# EAGLE design Pixel-X_Main_Control_v11 (EAGLE 7.7.0)
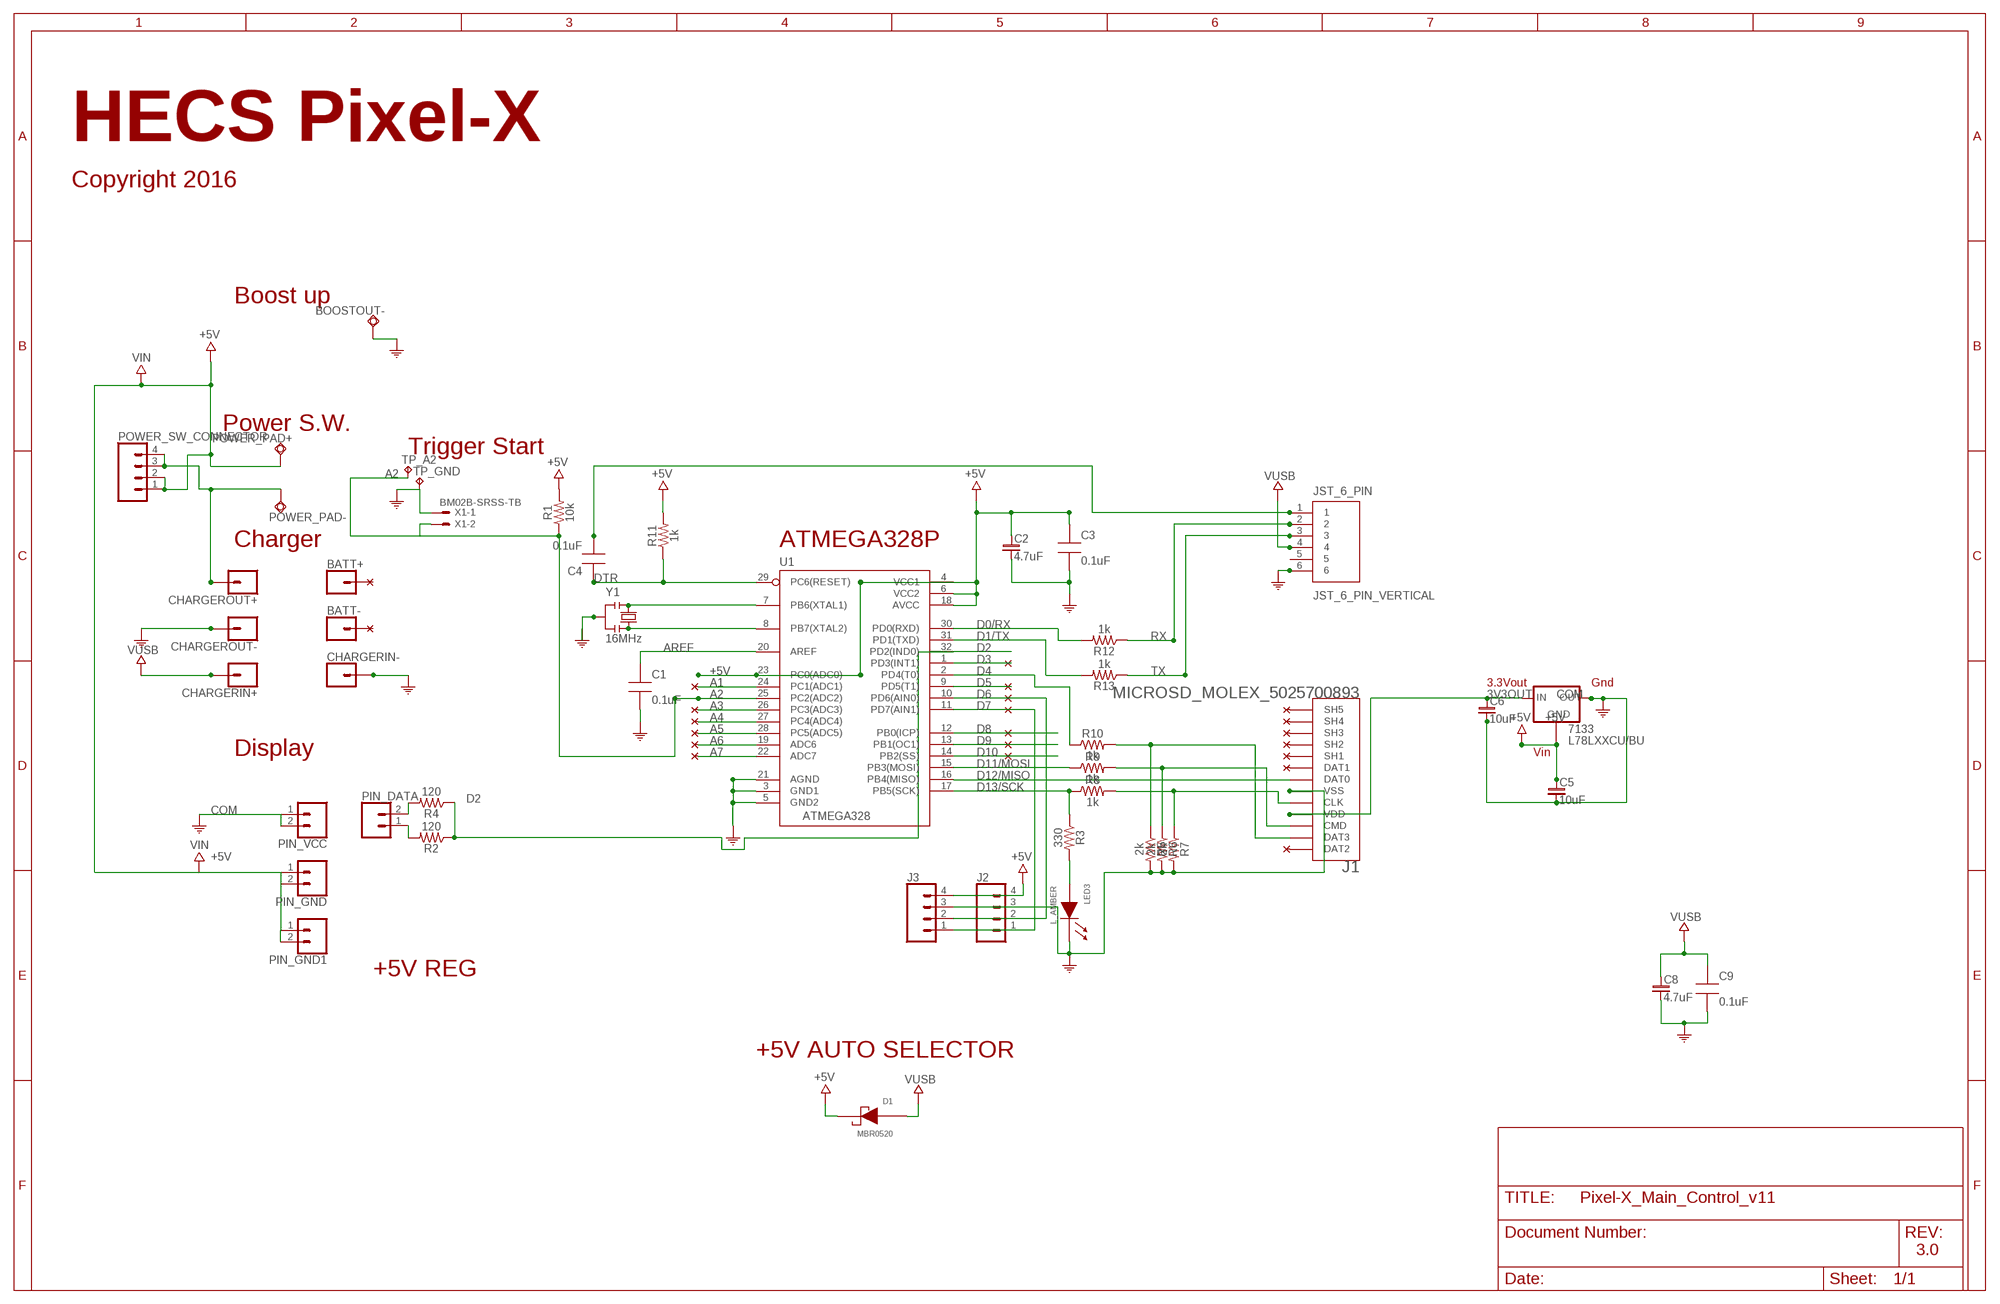
[diagram p0: schematic, sheet 1]

## Parts
7133  L78LXXCU/BU  [SOT89]
BATT+  CONN_01OFFSET  [1X01_OFFSET]
BATT-  CONN_01OFFSET  [1X01_OFFSET]
BOOSTOUT-  TPSQTP20R  [TP20R]
C1  0.1uF  CAP0805-NP  [CAP0805-NP]
C2  4.7uF  C_0805  [C0805]
C3  0.1uF  CAP0805-NP  [CAP0805-NP]
C4  0.1uF  CAP0805-NP  [CAP0805-NP]
C5  10uF  C_0805  [C0805]
C6  10uF  C_0805  [C0805]
C8  4.7uF  C_0805  [C0805]
C9  0.1uF  CAP0805-NP  [CAP0805-NP]
CHARGERIN+  CONN_01OFFSET  [1X01_OFFSET]
CHARGERIN-  CONN_01OFFSET  [1X01_OFFSET]
CHARGEROUT+  CONN_01OFFSET  [1X01_OFFSET]
CHARGEROUT-  CONN_01OFFSET  [1X01_OFFSET]
D1  MBR0520  [SOD-123]
J1  MICROSD_MOLEX_5025700893  [5025700893]
J2  CONN_04SMD2  [1X04_1MM_RA]
J3  CONN_04  [1X04]
JST_6_PIN  JST_6_PIN_VERTICAL  [JST-6-SMD-VERT-1.0MM]
LED3  L_AMBER  LED0805  [LED0805]
PIN_DATA  CONN_02  [1X02]
PIN_GND  CONN_02  [1X02]
PIN_GND1  CONN_02  [1X02]
PIN_VCC  CONN_02  [1X02]
POWER_PAD+  TPSQTP20R  [TP20R]
POWER_PAD-  TPSQTP20R  [TP20R]
POWER_SW_CONNECTOR  CONN_04SMD2  [1X04_1MM_RA]
R1  10k  0.05OHM-0603-1/5W-1%  [0603]
R2  120  0.05OHM-0603-1/5W-1%  [0603]
R3  330  0.05OHM-0603-1/5W-1%  [0603]
R4  120  0.05OHM-0603-1/5W-1%  [0603]
R5  2k  0.05OHM-0603-1/5W-1%  [0603]
R6  2k  0.05OHM-0603-1/5W-1%  [0603]
R7  2k  0.05OHM-0603-1/5W-1%  [0603]
R8  1k  0.05OHM-0603-1/5W-1%  [0603]
R9  1k  0.05OHM-0603-1/5W-1%  [0603]
R10  1k  0.05OHM-0603-1/5W-1%  [0603]
R11  1k  0.05OHM-0603-1/5W-1%  [0603]
R12  1k  0.05OHM-0603-1/5W-1%  [0603]
R13  1k  0.05OHM-0603-1/5W-1%  [0603]
TP_A2  TPTP12R  [TP12R]
TP_GND  TPTP12R  [TP12R]
U1  ATMEGA328  ATMEGA168-20AU  [QFP032]
X1  BM02B-SRSS-TB  [BM02B-SRSS-TB]
Y1  16MHz  RESONATORMU  [RESONATOR]

## Nets
3V3OUT: 7133.3(IN) C6.1 J1.P$4(VDD)
+5V: 7133.4(GND1) C2.1 C3.1 C5.1 D1.1(CA) J2.4 J3.4 PIN_GND1.1 PIN_GND1.2 PIN_GND.1 PIN_GND.2 POWER_PAD+.TP POWER_SW_CONNECTOR.1 POWER_SW_CONNECTOR.2 R1.2 R11.2 U1.4(VCC1) U1.6(VCC2) U1.18(AVCC) U1.23(PC0(ADC0)) ; supply symbol labelled VIN
A1: U1.24(PC1(ADC1))
A2: R1.1 TP_A2.TP U1.25(PC2(ADC2)) X1.2
A3: U1.26(PC3(ADC3))
A4: U1.27(PC4(ADC4))
A5: U1.28(PC5(ADC5))
A6: U1.19(ADC6)
A7: U1.22(ADC7)
AREF: C1.1 U1.20(AREF)
COM: 7133.1(OUT) BOOSTOUT-.TP C1.2 C2.2 C3.2 C5.2 C6.2 C8.2 C9.2 CHARGERIN-.1 CHARGEROUT-.1 J1.P$6(VSS) J2.3 J3.3 JST_6_PIN.6 LED3.1(CA) PIN_VCC.1 PIN_VCC.2 R5.2 R6.2 R7.2 TP_GND.TP U1.3(GND1) U1.5(GND2) U1.21(AGND) X1.1 Y1.2
D0/RX: R12.2 U1.30(PD0(RXD))
D1/TX: R13.2 U1.31(PD1(TXD))
D2: R2.1 R4.1 U1.32(PD2(IND0))
D3: U1.1(PD3(INT1))
D4: R10.1 U1.2(PD4(T0))
D5: U1.9(PD5(T1))
D6: J2.2 J3.2 U1.10(PD6(AIN0))
D7: J2.1 J3.1 U1.11(PD7(AIN1))
D8: U1.12(PB0(ICP))
D9: U1.13(PB1(OC1))
D10: U1.14(PB2(SS))
D11/MOSI: R9.1 U1.15(PB3(MOSI))
D12/MISO: J1.P$7(DAT0) U1.16(PB4(MISO))
D13/SCK: R3.1 R8.1 U1.17(PB5(SCK))
DTR: C4.1 R11.1 U1.29(PC6(RESET))
N$1: U1.8(PB7(XTAL2)) Y1.3
N$2: U1.7(PB6(XTAL1)) Y1.1
N$4: PIN_DATA.2 R4.2
N$5: PIN_DATA.1 R2.2
N$6: C4.2 JST_6_PIN.1
N$7: LED3.2(AN) R3.2
N$28: J1.P$2(DAT3) R5.1 R10.2
N$29: J1.P$3(CMD) R6.1 R9.2
N$30: J1.P$5(CLK) R7.1 R8.2
N$31: CHARGEROUT+.1 POWER_PAD-.TP POWER_SW_CONNECTOR.3 POWER_SW_CONNECTOR.4
RX: JST_6_PIN.2 R12.1
TX: JST_6_PIN.3 R13.1
VUSB: C8.1 C9.1 CHARGERIN+.1 D1.2(AN) JST_6_PIN.4
Unconnected: 7133.2(GND) BATT+.1 BATT-.1 J1.P$1(DAT2) J1.P$8(DAT1) JST_6_PIN.5

## Notes on the sheet
- HECS Pixel-X
- Copyright 2016
- Boost up
- Power S.W.
- Trigger Start
- Charger | ATMEGA328P
- 3.3Vout | Gnd
- Display | Vin
- +5V REG
- +5V AUTO SELECTOR
- 3.0

## Power pins joined to a net without a drawn wire
SH1: J1.GND0(SH1)
SH2: J1.GND1(SH2)
SH3: J1.GND2(SH3)
SH4: J1.GND3(SH4)
SH5: J1.GND4(SH5)

## Library data of the parts
7133 = v-reg-2:L78LXXCU/BU: VOLTAGE REGULATOR
BATT+ BATT- CHARGERIN+ CHARGERIN- CHARGEROUT+ CHARGEROUT- = SparkFun-Connectors:CONN_01: Single connection point. Often used as Generic Header-pin footprint for 0.1 inch spaced/style header connections On any of the 0.1 inch spaced packages, you can populate with these: Break Away Headers - Straight <https://www.sparkfun.com/products/116> (PRT-00116) Break Away Male Headers - Right Angle <https://www.sparkfun.com/products/553> (PRT-00553) Female Headers <https://www.sparkfun.com/products/115> (PRT-00115) Break Away Headers - Machine Pin <https://www.sparkfun.com/products/117> (PRT-00117) Break Away Female Headers - Swiss Machine Pin <https://www.sparkfun.com/products/743> (PRT-00743) This device is also useful as a general connection point to wire up your design to another part of your project. Our various solder wires solder well into these plated through hole pads. Hook-Up Wire - Assortment (Stranded, 22 AWG) <https://www.sparkfun.com/products/11375> (PRT-11375) Hook-Up Wire - Assortment (Solid Core, 22 AWG) <https://www.sparkfun.com/products/11367> (PRT-11367) View the entire wire category on our website here <https://www.sparkfun.com/categories/141> Special notes: SMTSO-256-ET is a "flush mount" nut for a 4-40 screw. We mostly use this on specialty testbeds; it is a nice way to connect hardware to your PCB at an adjustable hieght. Also note, the SNAP packages are for using a snappable style connector. We sell a baggie of snaps and they are also used on two LilyPad designs: Snap Assortment - 30 pack (male and female) <https://www.sparkfun.com/products/11347> (DEV-11347) LilyPad Arduino SimpleSnap <https://www.sparkfun.com/products/10941> (DEV-10941) LilyPad SimpleSnap Protoboard <https://www.sparkfun.com/products/10940> (DEV-10940)
BOOSTOUT- POWER_PAD+ POWER_PAD- = testpad:TPSQ: Test pad
C1 C3 C4 C9 = MySMD:CAP0805-NP
C2 C5 C6 C8 = rc-master-smd:C_: NON-POLARIZED CAP
D1 = MySMD:MBR0520
J1 = j_microsd_molex_5025700893:MICROSD_MOLEX_5025700893: Molex 5025700893 MicroSD Normal Mount SMT Connector
J2 POWER_SW_CONNECTOR = SparkFun-Connectors:CONN_04: Multi connection point. Often used as Generic Header-pin footprint for 0.1 inch spaced/style header connections On any of the 0.1 inch spaced packages, you can populate with these: Break Away Headers - Straight <https://www.sparkfun.com/products/116> (PRT-00116) Break Away Male Headers - Right Angle <https://www.sparkfun.com/products/553> (PRT-00553) Female Headers <https://www.sparkfun.com/products/115> (PRT-00115) Break Away Headers - Machine Pin <https://www.sparkfun.com/products/117> (PRT-00117) Break Away Female Headers - Swiss Machine Pin <https://www.sparkfun.com/products/743> (PRT-00743) For SCREWTERMINALS and SPRING TERMINALS visit here: Screw Terimnals on SparkFun.com <https://www.sparkfun.com/search/results?term=Screw+Terminals> (5mm/3.5mm/2.54mm spacing) This device is also useful as a general connection point to wire up your design to another part of your project. Our various solder wires solder well into these plated through hole pads. Hook-Up Wire - Assortment (Stranded, 22 AWG) <https://www.sparkfun.com/products/11375> (PRT-11375) Hook-Up Wire - Assortment (Solid Core, 22 AWG) <https://www.sparkfun.com/products/11367> (PRT-11367) View the entire wire category on our website here <https://www.sparkfun.com/categories/141> Special notes: Molex polarized connector foot print use with SKU : PRT-08231 with associated crimp pins and housings. 1MM SMD Version SKU: PRT-10208; PROD_ID: CONN-10310; SF_ID: PRT-10208
J3 = SparkFun-Connectors:CONN_04: Multi connection point. Often used as Generic Header-pin footprint for 0.1 inch spaced/style header connections On any of the 0.1 inch spaced packages, you can populate with these: Break Away Headers - Straight <https://www.sparkfun.com/products/116> (PRT-00116) Break Away Male Headers - Right Angle <https://www.sparkfun.com/products/553> (PRT-00553) Female Headers <https://www.sparkfun.com/products/115> (PRT-00115) Break Away Headers - Machine Pin <https://www.sparkfun.com/products/117> (PRT-00117) Break Away Female Headers - Swiss Machine Pin <https://www.sparkfun.com/products/743> (PRT-00743) For SCREWTERMINALS and SPRING TERMINALS visit here: Screw Terimnals on SparkFun.com <https://www.sparkfun.com/search/results?term=Screw+Terminals> (5mm/3.5mm/2.54mm spacing) This device is also useful as a general connection point to wire up your design to another part of your project. Our various solder wires solder well into these plated through hole pads. Hook-Up Wire - Assortment (Stranded, 22 AWG) <https://www.sparkfun.com/products/11375> (PRT-11375) Hook-Up Wire - Assortment (Solid Core, 22 AWG) <https://www.sparkfun.com/products/11367> (PRT-11367) View the entire wire category on our website here <https://www.sparkfun.com/categories/141> Special notes: Molex polarized connector foot print use with SKU : PRT-08231 with associated crimp pins and housings. 1MM SMD Version SKU: PRT-10208; PROD_ID: CONN-09696
JST_6_PIN = SparkFun-Connectors:JST_6_PIN_VERTICAL: JST 6 pin vertical connector Here is a six pin vertical 1.0mm pitch connector. It is useful if you need something very tiny as a connection. These are not the standard JST type connectors we use on most of our boards, but are actually the much smaller JST-SH type. Here is the connector we sell at SparkFun: JST SH Vertical 6-Pin Connector - SMD <https://www.sparkfun.com/products/579> (GPS-00579) Datasheet <http://www.sparkfun.com/datasheets/GPS/EM406-SMDConnector-eSH.pdf> It was used on these SparkFun products: SparkFun GPS Breakout <https://www.sparkfun.com/products/11818> (BOB-11818) SparkFun Weather Shield <https://www.sparkfun.com/products/12081> (DEV-12081) And many, many other GPS related products.; PROD_ID: CONN-08249; SF_ID: GPS-00579
LED3 = MySMD:LED0805
PIN_DATA PIN_GND PIN_GND1 PIN_VCC = SparkFun-Connectors:CONN_02: Multi connection point. Often used as Generic Header-pin footprint for 0.1 inch spaced/style header connections On any of the 0.1 inch spaced packages, you can populate with these: Break Away Headers - Straight <https://www.sparkfun.com/products/116> (PRT-00116) Break Away Male Headers - Right Angle <https://www.sparkfun.com/products/553> (PRT-00553) Female Headers <https://www.sparkfun.com/products/115> (PRT-00115) Break Away Headers - Machine Pin <https://www.sparkfun.com/products/117> (PRT-00117) Break Away Female Headers - Swiss Machine Pin <https://www.sparkfun.com/products/743> (PRT-00743) For SCREWTERMINALS and SPRING TERMINALS visit here: Screw Terimnals on SparkFun.com <https://www.sparkfun.com/search/results?term=Screw+Terminals> (5mm/3.5mm/2.54mm spacing) This device is also useful as a general connection point to wire up your design to another part of your project. Our various solder wires solder well into these plated through hole pads. Hook-Up Wire - Assortment (Stranded, 22 AWG) <https://www.sparkfun.com/products/11375> (PRT-11375) Hook-Up Wire - Assortment (Solid Core, 22 AWG) <https://www.sparkfun.com/products/11367> (PRT-11367) View the entire wire category on our website here <https://www.sparkfun.com/categories/141> Special notes: Molex polarized connector foot print use with: PRT-08233 with associated crimp pins and housings. 2.54_SCREWTERM for use with PRT-10571. 3.5mm Screw Terminal footprints for PRT-08084 5mm Screw Terminal footprints for use with PRT-08432
R1-R13 = SparkFun-Resistors:0.05OHM: 0.05Ω resistor A resistor is a passive two-terminal electrical component that implements electrical resistance as a circuit element. Resistors act to reduce current flow, and, at the same time, act to lower voltage levels within circuits. - Wikipedia; PROD_ID: RES-12535; VALUE: 0.05
TP_A2 TP_GND = testpad:TP: Test pad
U1 = MySMD:ATMEGA168-20AU
X1 = con-jst2:?M02B-SRSS-TB: Disconnectable Crimp style connector, 1.0mm pitch 2 contacts
Y1 = MySMD2:RESONATOR

## Board
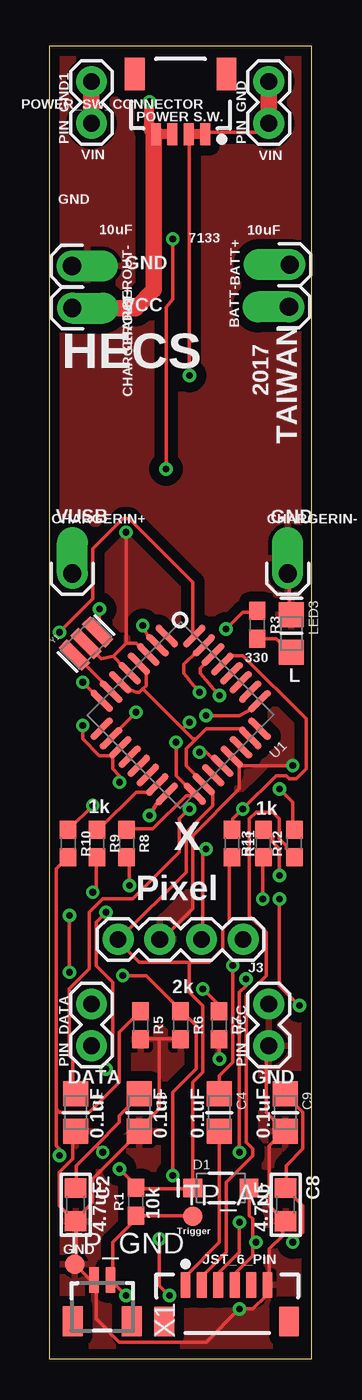
[diagram p1: board, top side]
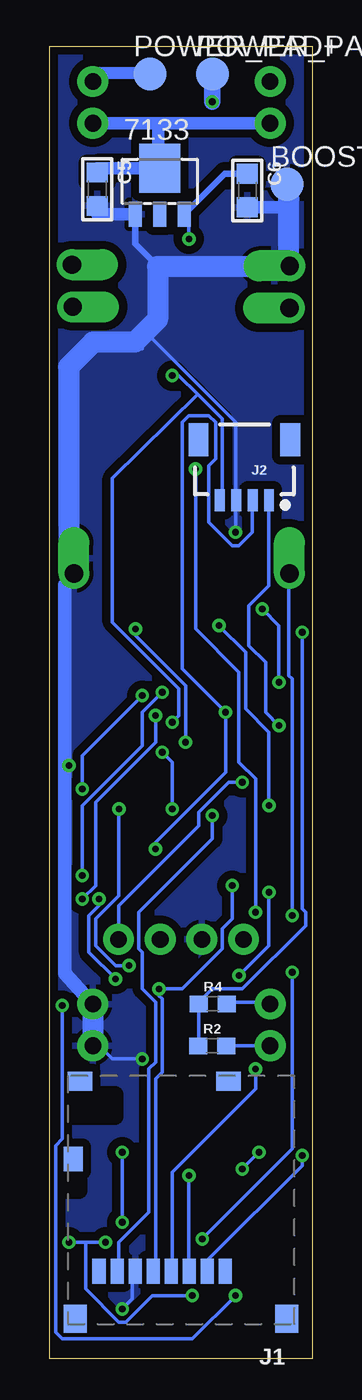
[diagram p2: board, bottom side, seen from below]

Size 16 x 80 mm. Coordinates in mm from the lower left corner, seen from the top.
Outline: 0,0 16,0 16,80 0,80 0,0
Copper layers (1*16): Top 0.035mm / dielectric 1.5mm / Bottom 0.035mm
Design rules "default *": minimum track width 8mil, minimum drill 16mil, track to track 8mil, track to pad 8mil, pad to pad 8mil, via to via 8mil, smd to smd 8mil, copper to edge 8mil, drill to drill 8mil, minimum pad ring 12mil, minimum via ring 8mil, stop-mask expansion 4mil, vias tented up to drill 18mil, thermal gap 10mil

### Footprints (pad centres in the part's own frame; a part is rotated, then mirrored left to right if it is on the bottom)
SOT89 = smd 0.8 x 1.5: 1 -1.5,-1.75; 2 0,-1.75; 3 1.5,-1.75 | smd 2.5 x 3: 4 0,1.05
1X01_OFFSET = drill 1.118 pad 1.88 offset: 1 0,0
TP20R = smd 2 x 2: TP 0,0
CAP0805-NP = smd 1.524 x 1.524: 1 0,0; 2 2.286,0
C0805 = smd 1.2 x 1.3: 1 -1.016,0; 2 1.016,0
SOD-123 = smd 1.143 x 1.143: 1 0,0; 2 3.429,0
5025700893 = smd 1.4 x 1.7: GND0 6.45,7.1; GND2 -6.45,7.1 | smd 1.5 x 1.15: GND1 6.15,-7.375; GND3 -2.9,-7.375 | smd 1.15 x 1.5: GND4 6.575,-2.65 | smd 0.8 x 1.5: P$1 -2.7,4.2; P$2 -1.6,4.2; P$3 -0.5,4.2; P$4 0.6,4.2; P$5 1.7,4.2; P$6 2.8,4.2; P$7 3.9,4.2; P$8 5,4.2
1X04_1MM_RA = smd 0.6 x 1.35: 1 -1.5,0; 2 -0.5,0; 3 0.5,0; 4 1.5,0 | smd 1.2 x 2: NC1 2.8,-3.675; NC2 -2.8,-3.675
1X04 = drill 1.016 pad 1.88: 1 0,0; 2 2.54,0; 3 5.08,0; 4 7.62,0
JST-6-SMD-VERT-1.0MM = smd 0.6 x 1.55: 1 -2.54,1.27; 2 -1.54,1.27; 3 -0.54,1.27; 4 0.46,1.27; 5 1.46,1.27; 6 2.46,1.27 | smd 1.2 x 1.8: P$1 -3.84,-0.955; P$2 3.76,-0.955
LED0805 = smd 1.524 x 1.524: 1 0,0; 2 2.286,0
1X02 = drill 1.016 pad 1.88: 1 0,0; 2 2.54,0
0603 = smd 1.1 x 1: 1 -0.85,0; 2 0.85,0
TP12R = smd 1.2 x 1.2: TP 0,0
QFP032 = smd 0.432 x 1.778: 1 0,0; 2 0.8,0; 3 1.599,0; 4 2.399,0; 5 3.199,0; 6 3.998,0; 7 4.798,0; 8 5.598,0; 17 5.588,8.001; 18 4.798,7.997; 19 3.998,7.997; 20 3.199,7.997; 21 2.399,7.997; 22 1.599,7.997; 23 0.799,7.997; 24 0,7.997 | smd 1.778 x 0.432: 9 6.807,1.194; 10 6.807,2.007; 11 6.807,2.794; 12 6.807,3.607; 13 6.807,4.394; 14 6.807,5.182; 15 6.807,5.994; 16 6.816,6.803; 25 -1.194,6.807; 26 -1.194,5.994; 27 -1.194,5.182; 28 -1.194,4.394; 29 -1.194,3.607; 30 -1.194,2.794; 31 -1.194,2.007; 32 -1.194,1.194
BM02B-SRSS-TB = smd 0.6 x 1.55: 1 0.5,-1.625; 2 -0.5,-1.625 | smd 1.2 x 1.8: FIT@1 1.8,0.9; FIT@2 -1.8,0.9
RESONATOR = smd 0.7 x 2: 1 -1,0; 2 0,0; 3 1,0

### Placement (x,y rotation side)
7133  9.3,71.53 0 bottom
BATT+  14.66,66.7 90 top
BATT-  14.61,64.14 90 top
BOOSTOUT-  1.55,71.6 0 bottom
C1  1.6,16.16 270 top
C2  1.6,9.41 270 top
C3  5.49,16.16 270 top
C4  10.36,16.16 270 top
C5  13.11,71.3 270 bottom
C6  3.96,71.22 270 bottom
C8  14.4,9.41 270 top
C9  14.38,16.16 270 top
CHARGERIN+  1.4,47.88 0 top
CHARGERIN-  14.53,47.88 0 top
CHARGEROUT+  1.4,64.06 270 top
CHARGEROUT-  1.37,66.62 270 top
D1  8.74,10.42 0 top
J1  8,9.55 180 bottom
J2  4.14,52.35 180 bottom
J3  11.81,25.58 180 top
JST_6_PIN  10.84,3.25 0 top
LED3  14.76,45.36 270 top
PIN_DATA  2.57,19.09 90 top
PIN_GND  13.38,75.32 90 top
PIN_GND1  2.57,75.32 90 top
PIN_VCC  13.38,19.09 90 top
POWER_PAD+  9.91,78.33 0 bottom
POWER_PAD-  6.1,78.33 0 bottom
POWER_SW_CONNECTOR  8,74.65 180 top
R1  5.28,9.59 90 top
R2  6.1,19.08 0 bottom
R3  12.67,44.75 270 top
R4  6.07,21.64 0 bottom
R5  5.56,20.35 270 top
R6  8,20.35 270 top
R7  10.34,20.35 270 top
R8  4.7,31.42 270 top
R9  2.9,31.42 270 top
R10  1.14,31.42 270 top
R11  11.13,31.42 270 top
R12  14.94,31.42 90 top
R13  13.06,31.42 90 top
TP_A2  8.74,8.7 0 top
TP_GND  1.55,5.77 0 top
U1  7.15,44.07 225 top
X1  3.23,3.2 180 top
Y1  2.24,43.61 45 top

### Tracks (layer width: path | path; a pad name or v marks a point on that pad's centre or on a via)
3V3OUT  (via drill 0.41)
  Top 0.203: v3.45,17.68 3.45,18.09 3.86,18.49 3.86,22.96 2.85,23.98 2.85,26.62 v3.45,27.23 | v7.11,54.25 7.11,64.11 7.52,64.59 v7.52,68.28
  Bottom 0.203: v3.45,17.68 3.45,16.46 8.53,11.38 8.53,5.49 J1.P$4 | v3.45,27.23 3.45,35.36 4.47,36.37 4.47,41.86 7.11,44.5 v7.11,54.25 | v7.52,68.28 7.52,69.9 7133.3
  Bottom 0.406: C6.1 5.33,72.24 7133.3
+5V  (via drill 0.41)
  Top 0.203: 2.55,75.59 PIN_GND1.1 | 13.37,74.95 PIN_GND.1 13.01,74.78 9.75,74.78 POWER_SW_CONNECTOR.1 | v8.53,59.94 8.53,74.37 POWER_SW_CONNECTOR.2 | 5.69,40.84 5.89,41.05 5.89,41.86 5.49,42.27 U1.4 | 5.69,40.84 5.49,40.64 5.28,40.64 4.7,40.87 4.47,41.05 U1.6 | 8.94,37.8 9.55,38.41 11.79,38.41 12.19,38 U1.23 | 8.94,37.8 8.33,37.19 8.33,36.17 9.35,35.15 U1.18 9.55,34.95 9.55,34.8 9.96,34.39 9.96,33.73 8.33,32.11 8.33,29.67 4.27,25.6 J3.4 4.27,25.4 5.49,24.18 8.53,24.18 | 8.13,38.41 8.74,37.8 8.94,37.8 | 8.13,38.41 5.69,40.84 | 2.85,13.01 4.27,14.43 4.27,14.83 5.49,16.05 C3.1 | 2.85,13.01 1.63,11.79 1.63,10.57 C2.1 | 8.53,24.18 9.75,24.18 10.57,24.99 10.57,26.21 10.97,26.62 10.97,30.48 R11.2 | 8.53,24.18 8.53,22.35 9.35,21.54 9.35,17.48 8.74,16.87 D1.1 8.74,10.36 5.28,10.36 R1.2 5.28,10.57 v4.27,11.58 | v3.25,12.6 2.85,13.01 | 8.13,38.41 v8.53,38.81
  Top 0.61: POWER_SW_CONNECTOR.1 POWER_SW_CONNECTOR.2
  Top 0.762: 2.55,77.81 PIN_GND1.2 | 13.34,74.93 13.34,75.25 PIN_GND.1 | 13.37,78.12 PIN_GND.2
  Top 1: 2.55,77.81 2.55,75.59 | 13.37,74.95 13.37,78.12
  Bottom 0.203: 9.93,78.38 POWER_PAD+.TP | 6.99,58.8 8.13,59.94 v8.53,59.94 | 6.99,58.8 5.49,57.3 5.49,52.43 J2.4 | v4.27,11.58 v3.25,12.6 | 6.99,58.8 12.19,53.67 12.19,44.91 8.13,40.84 8.13,39.22 v8.53,38.81
  Bottom 0.762: 9.93,78.38 13.36,78.36 PIN_GND.2 | PIN_GND1.1 9.4,75.32 | 9.4,75.32 PIN_GND.1 | 9.4,75.32 9.4,72.58 7133.4 13.11,72.58 C5.1
A2  (via drill 0.41)
  Top 0.203: TP_A2.TP 8.74,8.74 R1.1 5.28,8.53 3.86,7.11 3.86,4.88 X1.2 3.86,4.67 v4.67,3.86 | v9.55,39.22 11.58,39.22 12.32,39.6 12.55,39.8 12.8,40.03 U1.25 | v14.02,28.04 14.02,22.76 v15.24,21.54
  Bottom 0.203: v9.55,39.22 9.55,37.59 13.21,33.93 13.21,28.85 v14.02,28.04 | v15.24,21.54 15.24,13.41 15.65,13.01 15.65,1.63 15.24,1.22 7.32,1.22 v4.67,3.86
AREF  (via drill 0.41)
  Top 0.203: v8.53,33.53 7.92,32.92 7.92,30.89 5.08,28.04 3.25,28.04 2.44,27.23 2.44,23.77 1.22,22.55 1.22,18.49 1.42,18.29 1.42,16.26 C1.1 | v9.14,36.98 9.55,36.98 10.36,36.17 U1.20
  Bottom 0.203: v8.53,33.53 8.53,36.37 v9.14,36.98
COM  (via drill 0.41)
  Top 0.203: 6.71,19.51 7.92,19.51 R6.2 | 6.71,19.51 5.69,19.51 R5.2 | 6.71,19.51 6.71,15.24 5.49,14.02 C3.2 5.49,13.82 2.64,10.97 2.64,9.55 1.63,8.53 C2.2 | C2.2 1.63,8.33 1.63,5.89 TP_GND.TP 2.64,4.67 X1.1 2.85,4.67 2.85,2.44 4.27,1.02 9.55,1.02 v11.58,3.05 12.39,3.05 13.21,3.86 13.21,4.47 JST_6_PIN.6 13.41,4.67 13.41,6.71 14.22,7.52 14.22,8.33 C8.2 14.22,8.53 13.41,9.35 13.41,13.01 14.22,13.82 C9.2 14.22,14.02 13.21,15.04 13.21,18.9 PIN_VCC.1 | C1.2 1.42,13.82 1.42,12.19 0.61,11.38 0.61,9.35 1.42,8.53 C2.2 | 11.58,36.17 11.18,36.58 U1.21 11.58,36.17 | 11.58,36.17 11.58,34.75 8.74,31.9 8.74,27.43 6.91,25.6 J3.3 | 3.89,42.82 3.15,42.67 2.29,43.54 Y1.2 | 3.89,42.82 4.5,42.19 4.88,41.86 U1.5 | 4.67,43.64 5.31,43.64 5.89,43.08 U1.3 | 3.89,42.82 4.67,43.64 | v10.36,18.29 10.36,19.3 R7.2 | LED3.1 14.63,45.52 14.63,47.75 CHARGERIN-.1 | v4.67,50.39 4.67,43.64 | v14.83,36.17 11.58,36.17
  Bottom 0.203: 1.42,71.53 BOOSTOUT-.TP | 1.42,66.65 CHARGEROUT-.1 | 15.25,28.75 15.09,28.75 | 15.04,28.65 15.09,28.65 | 10.36,61.57 10.82,61.98 | v11.58,3.05 10.97,3.66 10.97,5.28 J1.P$6 | v10.36,18.29 12.19,18.29 12.8,18.9 PIN_VCC.1 | 10.19,62.61 4.67,57.1 4.67,52.43 J2.3 4.67,52.22 v4.67,50.39 | v14.83,36.17 15.09,36.17
  Bottom 0.406: 7133.1 10.8,67.97 9.42,66.6
  Bottom 0.762: 7133.1 13.11,69.78 C5.2 | C6.2 1.42,70.21 1.42,70.69
  Bottom 0.813: PIN_VCC.2 15.09,23.52 15.09,28.65 15.09,28.75 15.09,36.17 15.09,47.19 CHARGERIN-.1
  Bottom 1.27: 1.42,66.65 1.42,70.69 1.42,71.53 | PIN_VCC.2 PIN_VCC.1 | CHARGEROUT-.1 1.4,66.6 9.42,66.6 9.42,63.37 10.19,62.61 10.82,61.98 13.36,61.98 14.86,60.48 14.86,48.21 CHARGERIN-.1
  pour Top (isolate 0.61): 0.25,79.75 15.75,79.75 15.75,0.25 0.25,0.25
  pour Bottom (isolate 0.508): 0.25,79.75 15.75,79.75 15.75,0.25 0.25,0.25
D0/RX  (via drill 0.41)
  Top 0.203: v14.02,34.75 14.83,33.93 14.83,32.31 R12.2 | 10.26,40.56 v10.36,40.44 9.2,41.78 9.2,42.11 9.3,42.19 9.55,42.47 9.96,42.88 U1.30
  Bottom 0.203: v14.02,34.75 14.02,36.78 v10.36,40.44
D1/TX  (via drill 0.41)
  Top 0.203: v14.02,29.46 14.02,31.09 13.61,31.5 13.61,31.7 13.21,32.11 R13.2 | v9.14,40.64 8.51,41.4 8.48,41.43 8.18,41.81 8.18,42.34 8.94,43.08 9.35,43.48 U1.31
  Bottom 0.203: v14.02,29.46 14.02,33.73 10.36,37.39 10.36,39.42 v9.14,40.64
D2  (via drill 0.41)
  Top 0.203: v0.61,44.3 2.64,46.33 2.64,49.38 4.47,51.21 4.88,51.21 8.74,47.35 8.74,44.09 U1.32
  Bottom 0.203: R2.1 6.91,19.1 6.91,21.54 R4.1 6.91,21.74 6.1,22.55 4.27,22.55 0.41,26.42 0.41,27.23 0.61,27.43 v0.61,44.3
D4  (via drill 0.41)
  Top 0.203: v2.64,33.73 1.22,32.31 R10.1 | v5.69,44.7 5.99,44.09 U1.2
  Bottom 0.203: v2.64,33.73 2.64,38.2 4.06,39.62 4.06,43.08 v5.69,44.7
D6  (via drill 0.41)
  Top 0.203: v5.28,39.42 3.86,38 U1.10 | v9.55,31.09 9.35,30.89 9.35,25.6 J3.2
  Bottom 0.203: J2.2 3.66,52.22 3.66,50.39 4.47,49.58 4.88,49.58 6.3,51 6.3,54.46 5.89,54.86 5.89,57.1 6.3,57.51 7.52,57.51 7.92,57.1 7.92,42.06 v5.28,39.42 5.28,35.76 9.55,31.5 v9.55,31.09
D7  (via drill 0.41)
  Top 0.203: v2.03,38.61 2.03,37.8 3.05,36.78 3.86,36.78 | 3.86,36.78 4.27,37.19 U1.11 3.86,36.78 | v4.27,35.15 4.27,35.56 3.86,35.97 3.86,36.78
  Bottom 0.203: v2.03,38.61 2.85,39.42 2.85,42.47 3.86,43.48 3.86,45.92 2.64,47.14 2.64,52.22 J2.1 | v4.27,35.15 5.08,35.15 6.91,33.33 6.91,32.51 11.79,27.64 11.79,25.6 J3.1
D11/MOSI
  Top 0.203: R9.1 3.05,32.31 5.28,34.54 6.1,34.54 6.5,34.95 U1.15
D12/MISO  (via drill 0.41)
  Top 0.203: v6.1,33.12 6.53,33.81 U1.16
  Bottom 0.203: v6.1,33.12 6.1,31.7 10.57,27.23 10.57,24.99 10.36,24.79 10.36,22.55 9.55,21.74 9.55,18.09 9.96,17.68 9.96,8.94 11.79,7.11 11.79,5.49 J1.P$7
D13/SCK  (via drill 0.41)
  Top 0.203: R8.1 4.88,32.31 6.3,32.31 8.33,34.34 8.74,34.34 U1.17 8.74,34.54 7.72,35.56 v7.72,37.59 | v10.77,44.5 11.79,45.52 12.6,45.52 R3.1
  Bottom 0.203: v10.77,44.5 10.77,44.09 7.72,41.05 v7.72,37.59
DTR  (via drill 0.41)
  Top 0.203: R11.1 11.18,32.31 11.18,32.92 v11.79,33.53 13.82,35.56 14.43,35.56 14.63,35.36 15.04,35.36 15.65,35.97 15.65,39.01 11.79,42.88 10.97,42.88 10.57,42.47 U1.29 | C4.1 10.36,17.27 11.18,18.09 v11.18,23.98
  Bottom 0.203: v11.18,23.98 11.99,23.98 13.21,25.2 13.21,26.82 11.79,28.25 v11.79,33.53
N$1  (via drill 0.41)
  Top 0.203: v2.03,41.25 3.05,40.23 U1.8 | v3.05,45.72 3.05,44.5 Y1.3
  Bottom 0.203: v2.03,41.25 2.03,44.7 v3.05,45.72
N$2
  Top 0.203: U1.7 3.66,40.84 1.63,42.88 Y1.1
N$4
  Bottom 0.203: R4.2 5.08,21.74 2.64,21.74 PIN_DATA.2
N$5
  Bottom 0.203: R2.2 5.08,19.1 2.64,19.1 PIN_DATA.1
N$6
  Top 0.203: C4.2 10.36,7.11 8.33,5.08 8.33,4.67 JST_6_PIN.1
N$7
  Top 0.203: R3.2 12.8,43.89 13.82,43.89 14.63,43.08 LED3.2
N$28  (via drill 0.41)
  Top 0.203: 0.41,15.24 0.61,15.04 2.44,15.04 4.27,16.87 4.27,19.91 5.49,21.13 R5.1 | 0.41,15.24 0.41,29.87 1.02,30.48 R10.2 | v0.61,12.39 0.61,12.8 0.41,13.01 0.41,15.24
  Bottom 0.203: v0.61,12.39 0.61,11.79 6.3,6.1 6.3,5.49 J1.P$2
N$29  (via drill 0.41)
  Top 0.203: v7.52,11.18 7.52,16.26 8.94,17.68 8.94,20.32 8.13,21.13 R6.1 7.92,21.34 5.89,23.37 v4.47,23.37 | v2.64,28.45 2.85,28.65 2.85,30.48 R9.2
  Bottom 0.203: v7.52,11.18 7.52,5.49 J1.P$3 | v2.64,28.45 2.64,25.2 v4.47,23.37
N$30  (via drill 0.41)
  Top 0.203: v9.35,22.55 10.16,21.74 10.16,21.34 R7.1 | v4.88,28.85 4.88,30.48 R8.2
  Bottom 0.203: J1.P$5 9.55,5.49 9.55,17.07 9.14,17.48 9.14,21.95 9.35,22.15 v9.35,22.55 7.92,22.55 5.49,24.99 5.49,26.21 4.88,26.82 v4.88,28.85
N$31  (via drill 0.41)
  Top 0.203: 6.5,74.78 POWER_SW_CONNECTOR.4 | 6.1,74.78 6.38,74.53
  Top 0.61: POWER_SW_CONNECTOR.3 POWER_SW_CONNECTOR.4 | 6.1,74.78 v6.1,76.63
  Top 1.016: POWER_SW_CONNECTOR.4 6.38,74.53 6.38,65.18 5.26,64.06 CHARGEROUT+.1
  Bottom 1.016: v6.1,76.63 POWER_PAD-.TP
RX
  Top 0.203: R12.1 14.83,30.68 14.43,31.09 14.43,31.29 14.02,31.7 14.02,32.92 13.61,33.33 12.6,33.33 12.19,32.92 12.19,27.03 13.21,26.01 13.21,23.37 11.99,22.15 11.99,13.21 12.39,12.8 12.39,12.39 10.77,10.77 10.77,6.5 9.35,5.08 9.35,4.67 JST_6_PIN.2
TX  (via drill 0.41)
  Top 0.203: v13.01,28.04 13.01,30.48 R13.1 | v11.99,23.16 11.99,22.76 11.58,22.35 v11.58,12.6 | v11.58,8.33 11.58,6.5 10.36,5.28 10.36,4.67 JST_6_PIN.3
  Bottom 0.203: v13.01,28.04 13.01,27.64 13.61,27.03 13.61,24.79 v11.99,23.16 | v11.58,8.33 v11.58,12.6
VUSB  (via drill 0.41)
  Top 0.203: C9.1 14.43,16.05 15.44,15.04 15.44,12.8 14.43,11.79 14.43,10.57 C8.1 14.43,10.36 15.44,9.35 15.44,7.72 v14.83,7.11 | 12.39,7.11 12.39,6.3 11.38,5.28 11.38,4.67 JST_6_PIN.4 | 12.39,7.11 12.39,8.53 12.19,8.74 12.19,10.36 D1.2 | 12.39,7.11 v12.6,7.11 | v1.22,23.57 v1.22,27.03 | v6.71,7.32 6.71,4.47 v7.32,3.86
  Bottom 0.203: v12.6,7.11 13.82,7.11 | 13.82,7.11 v14.83,7.11 | v1.22,27.03 1.22,41.45 1.42,41.66 1.42,47.75 CHARGERIN+.1 | v1.22,23.57 1.22,12.8 v6.71,7.32 | v7.32,3.86 9.75,3.86 11.38,2.23 11.79,2.23 13.82,4.27 13.82,7.11

### Text on the board
tPlace: POWER S.W. | VIN | VIN | GND | 10uF | 10uF | 7133 | GND | VCC | HECS | 2017 | TAIWAN | VUSB | GND | 330 | L | 1k | 1k | X | Pixel | 2k | DATA | GND | 0.1uF | 0.1uF | 0.1uF | 0.1uF | 10k | 4.7uF | Trigger | 4.7uF | GND